# Altium schematic sheet Battery.SchDoc: Battery
size A4; Date: 2016/01/04; Author: Samuel López; DocumentNumber: 3; SheetNumber: 3; SheetTotal: 7; Project: H2H Main Board
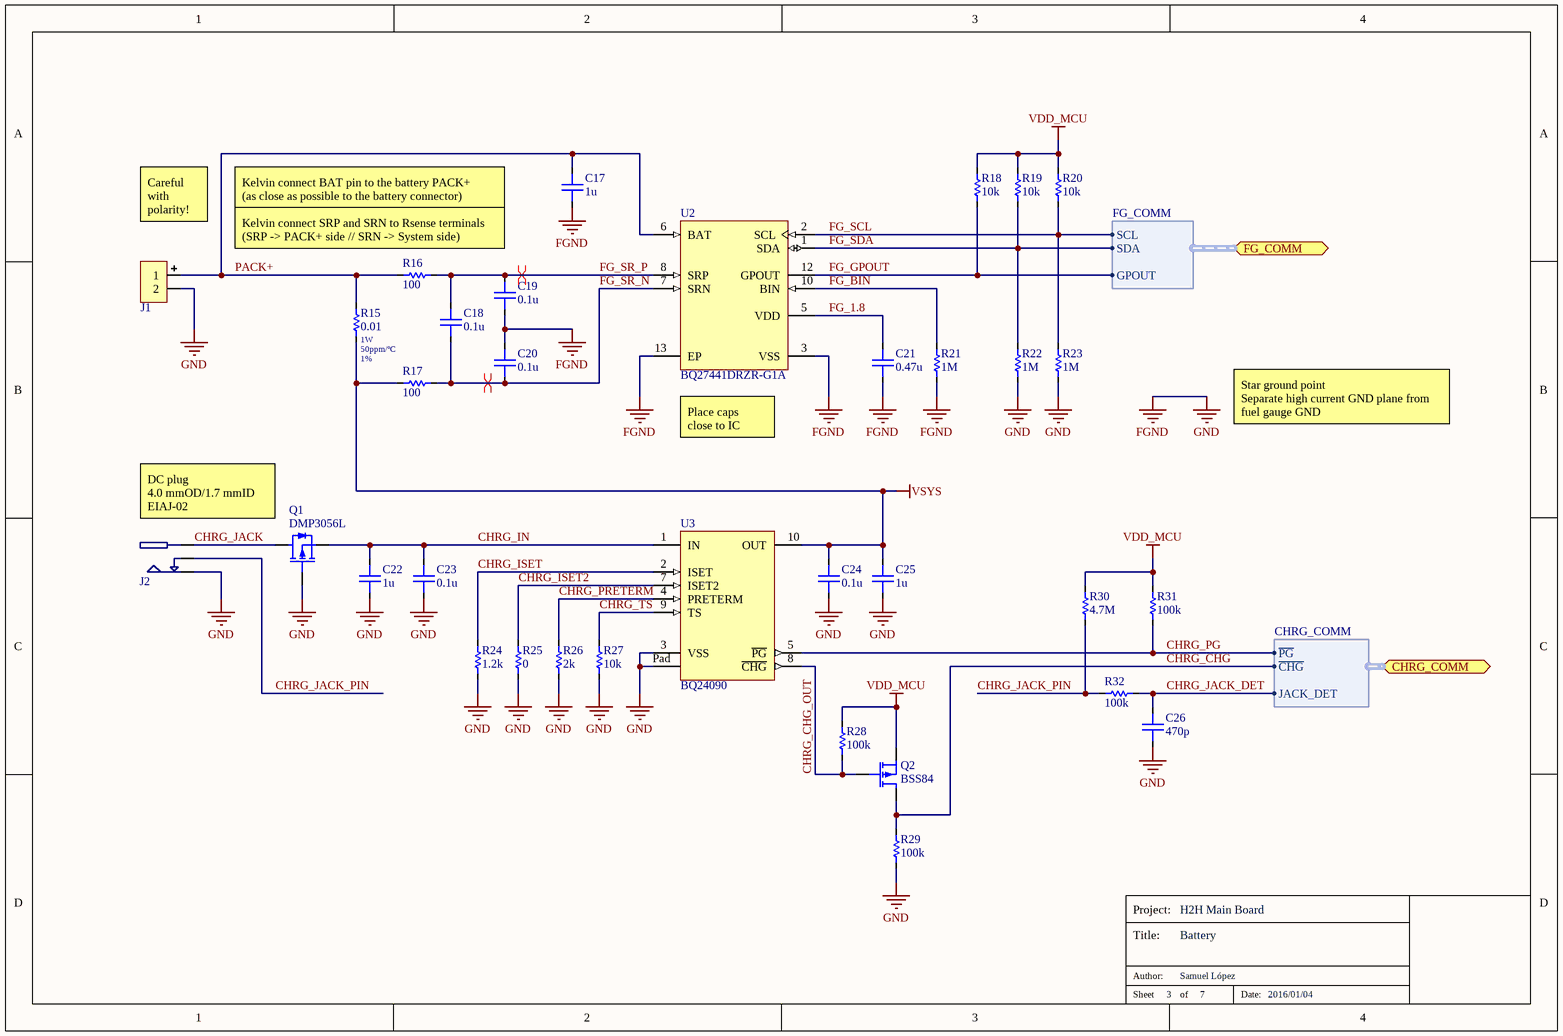
[diagram p0: Battery.SchDoc]

## Parts
C17  1u  [C0603]
C18  0.1u  [C0603]
C19  0.1u  [C0603]
C20  0.1u  [C0603]
C21  0.47u  [C0603]
C22  1u  [C0603]
C23  0.1u  [C0603]
C24  0.1u  [C0603]
C25  1u  [C0603]
C26  470p  [C0603]
J1  JST PH 2 Pin  [S2B-PH-K-S]  (value not drawn)
J2  PJ-018H-SMT  [PJ-018H-SMT]  (value not drawn)
Q1  DMP3056L  [DMP3056L]
Q2  BSS84  [BSS84]
R15  0.01  Power: 1W  Tolerance: 1%  Temp. coef.: 50ppm/ºC  [R1206]
R16  100  [R0603]
R17  100  [R0603]
R18  10k  [R0603]
R19  10k  [R0603]
R20  10k  [R0603]
R21  1M  [R0603]
R22  1M  [R0603]
R23  1M  [R0603]
R24  1.2k  [R0603]
R25  0  [R0603]
R26  2k  [R0603]
R27  10k  [R0603]
R28  100k  [R0603]
R29  100k  [R0603]
R30  4.7M  [R0603]
R31  100k  [R0603]
R32  100k  [R0603]
U2  BQ27441DRZR-G1A  [BQ27441DRZx-G1A]
U3  BQ24090  [BQ24090]

## Ports
CHRG_COMM (harness CHRG_COMM), FG_COMM (harness FG_COMM)

## Harnesses
FG_COMM: SCL, SDA, GPOUT
CHRG_COMM: ~{PG}, ~{CHG}, JACK_DET

## Nets
FGND: C17.1 C19.1 C20.2 C21.1 C22.1 C23.1 C24.1 C25.1 C26.1 J1.2 J2.2 Q1.1(G) R21.2 R22.2 R23.2 R24.2 R25.2 R26.2 R27.2 R29.2 U2.3(VSS) U2.13(EP) U3.3(VSS) U3.Pad(Thermal)  [also labelled GND]
VDD_MCU: Q2.2(S) R18.1 R19.1 R20.1 R28.1 R30.1 R31.1
VSYS: C24.2 C25.2 R15.2 R17.1 U3.10(OUT)
CHRG_CHG: Q2.3(D) R29.1 ; port CHRG_COMM.~{CHG}
CHRG_CHG_OUT: Q2.1(G) R28.2 U3.8(~{CHG})
CHRG_IN: C22.2 C23.2 Q1.2(S) U3.1(IN)
CHRG_ISET: R24.1 U3.2(ISET)
CHRG_ISET2: R25.1 U3.7(ISET2)
CHRG_JACK: J2.1 Q1.3(D)
CHRG_JACK_DET: C26.2 R32.1 ; port CHRG_COMM.JACK_DET
CHRG_JACK_PIN: J2.3 R30.2 R32.2
CHRG_PG: R31.2 U3.5(~{PG}) ; port CHRG_COMM.~{PG}
CHRG_PRETERM: R26.1 U3.4(PRETERM)
CHRG_TS: R27.1 U3.9(TS)
FG_1.8: C21.2 U2.5(VDD)
FG_BIN: R21.1 U2.10(BIN)
FG_GPOUT: R18.2 U2.12(GPOUT) ; port FG_COMM.GPOUT
FG_SCL: R20.2 R23.1 U2.2(SCL) ; port FG_COMM.SCL
FG_SDA: R19.2 R22.1 U2.1(SDA) ; port FG_COMM.SDA
FG_SR_N: C18.1 C20.1 R17.2 U2.7(SRN)
FG_SR_P: C18.2 C19.2 R16.2 U2.8(SRP)
PACK+: C17.2 J1.1 R15.1 R16.1 U2.6(BAT)

## Layout directives
differential pair: FG_SR_N, FG_SR_P

## Notes on the sheet
- Careful with
  polarity!
- Kelvin connect BAT pin to the battery PACK+
  (as close as possible to the battery connector)
- Kelvin connect SRP and SRN to Rsense terminals
  (SRP -> PACK+ side // SRN -> System side)
- (near U2) Place caps
  close to IC
- Star ground point
  Separate high current GND plane from
  fuel gauge GND
- DC plug
  4.0 mmOD/1.7 mmID
  EIAJ-02
- Project:
- Title:
- Sheet
- Author:
- of
- Date:

## Library data of the parts
C17-C26 = Capacitor: Rated Voltage: *
  C17 C22 C25: Value: 1u
  C18-C20 C23 C24: Value: 0.1u
  C21: Value: 0.47u
  C26: Value: 470p
J1 = S2B-PH-K-S: Conn - Battery, Male, 2 Pin, PCB, Right Angle; Supplier 1: Digi-Key; Supplier Part Number 1: 455-1719-ND
J2 = PJ-018H-SMT: Conn - DC Power Plug - 4.0 mmOD / 1.7 mmID; Inner Diameter: 1.7 mm; Outer Diameter: 4.0 mm; DC Conn Standard: EIAJ-02; Supplier 1: Digi-Key; Supplier Part Number 1: CP-018HPJCT-ND
Q1 = DMP3056L: Transistor - MOSFET, P-Channel, 30V, 4.3A; RDSon @ VGS =-4.5V: 50 m; Supplier 1: Digi-Key; Supplier Part Number 1: DMP3056L-7DICT-ND
Q2 = BSS84: Transistor - MOSFET, P-Channel, 50V, 130mA; Supplier 1: Digi-Key; Supplier Part Number 1: BSS84CT-ND
R15-R32 = Resistor
  R15: Value: 0.01; Supplier 1: Digi-Key; Supplier Part Number 1: MCS1632R010FERCT-ND
  R16 R17: Value: 100; Power: *
  R18-R20 R27: Value: 10k; Power: *
  R21-R23: Value: 1M; Power: *
  R24: Value: 1.2k; Power: *
  R25: Value: 0; Power: *
  R26: Value: 2k; Power: *
  R28 R29 R31 R32: Value: 100k; Power: *
  R30: Value: 4.7M; Power: *
U2 = BQ27441DRZR-G1A: IC - Fuel Gauge, System-Side Impedance Track; PartNumber: BQ27410DRZR-G1A; Manufacturer: Texas Instruments; Eco-Plan: Green (RoHS & no Sb/Br); Lead Acid: N; Li-Ion: Y; SubFamily: Battery Fuel Gauge; DatasheetVersion: SLUSAF4; PackageVersion: revB, Apr-2006; PackageReference: DRZ12-1950X2450TP; PackageDescription: 12-Pin Plastic Small Outline No-Lead, 4 x 2.5 x 1 mm Body, 0.4 mm Pitch, Exposed Pad, Pb-Free; Li-Polymer: Y; NiCd: N; NiMH: N; Over Voltage Protection: N; Mounting Technology: Surface Mount; ComponentLink1Description: Datasheet; ComponentLink1URL: http://www.ti.com/general/docs/lit/getliterature.tsp?genericPartNumber=BQ27410-G1&fileType=pdf; Supplier 1: Digi-Key; Supplier Part Number 1: 296-39941-1-ND
U3 = BQ24090: IC - Battery Charger, Single Cell Li-Ion/LiPo, 1A; Supplier 1: Digi-Key; Supplier Part Number 1: 296-38875-1-ND